# Altium schematic sheet REUN.468349.001_PSU_Board_Connectors.SchDoc: Плата распределения
size 420 x 297 mm; Date: 10.06.22; ApprovedBy: Шавликов; CheckedBy: Мамаев; DrawnBy: Подлесный; DocumentNumber: РЕУН.468349.001 Э3 2D; SheetNumber: 1; SheetTotal: 7; Title1str: питания; DocumentType: Схема электрическая принципиальная; Format: A3; ImagePath: РЕУН.468349.001 ТЭ
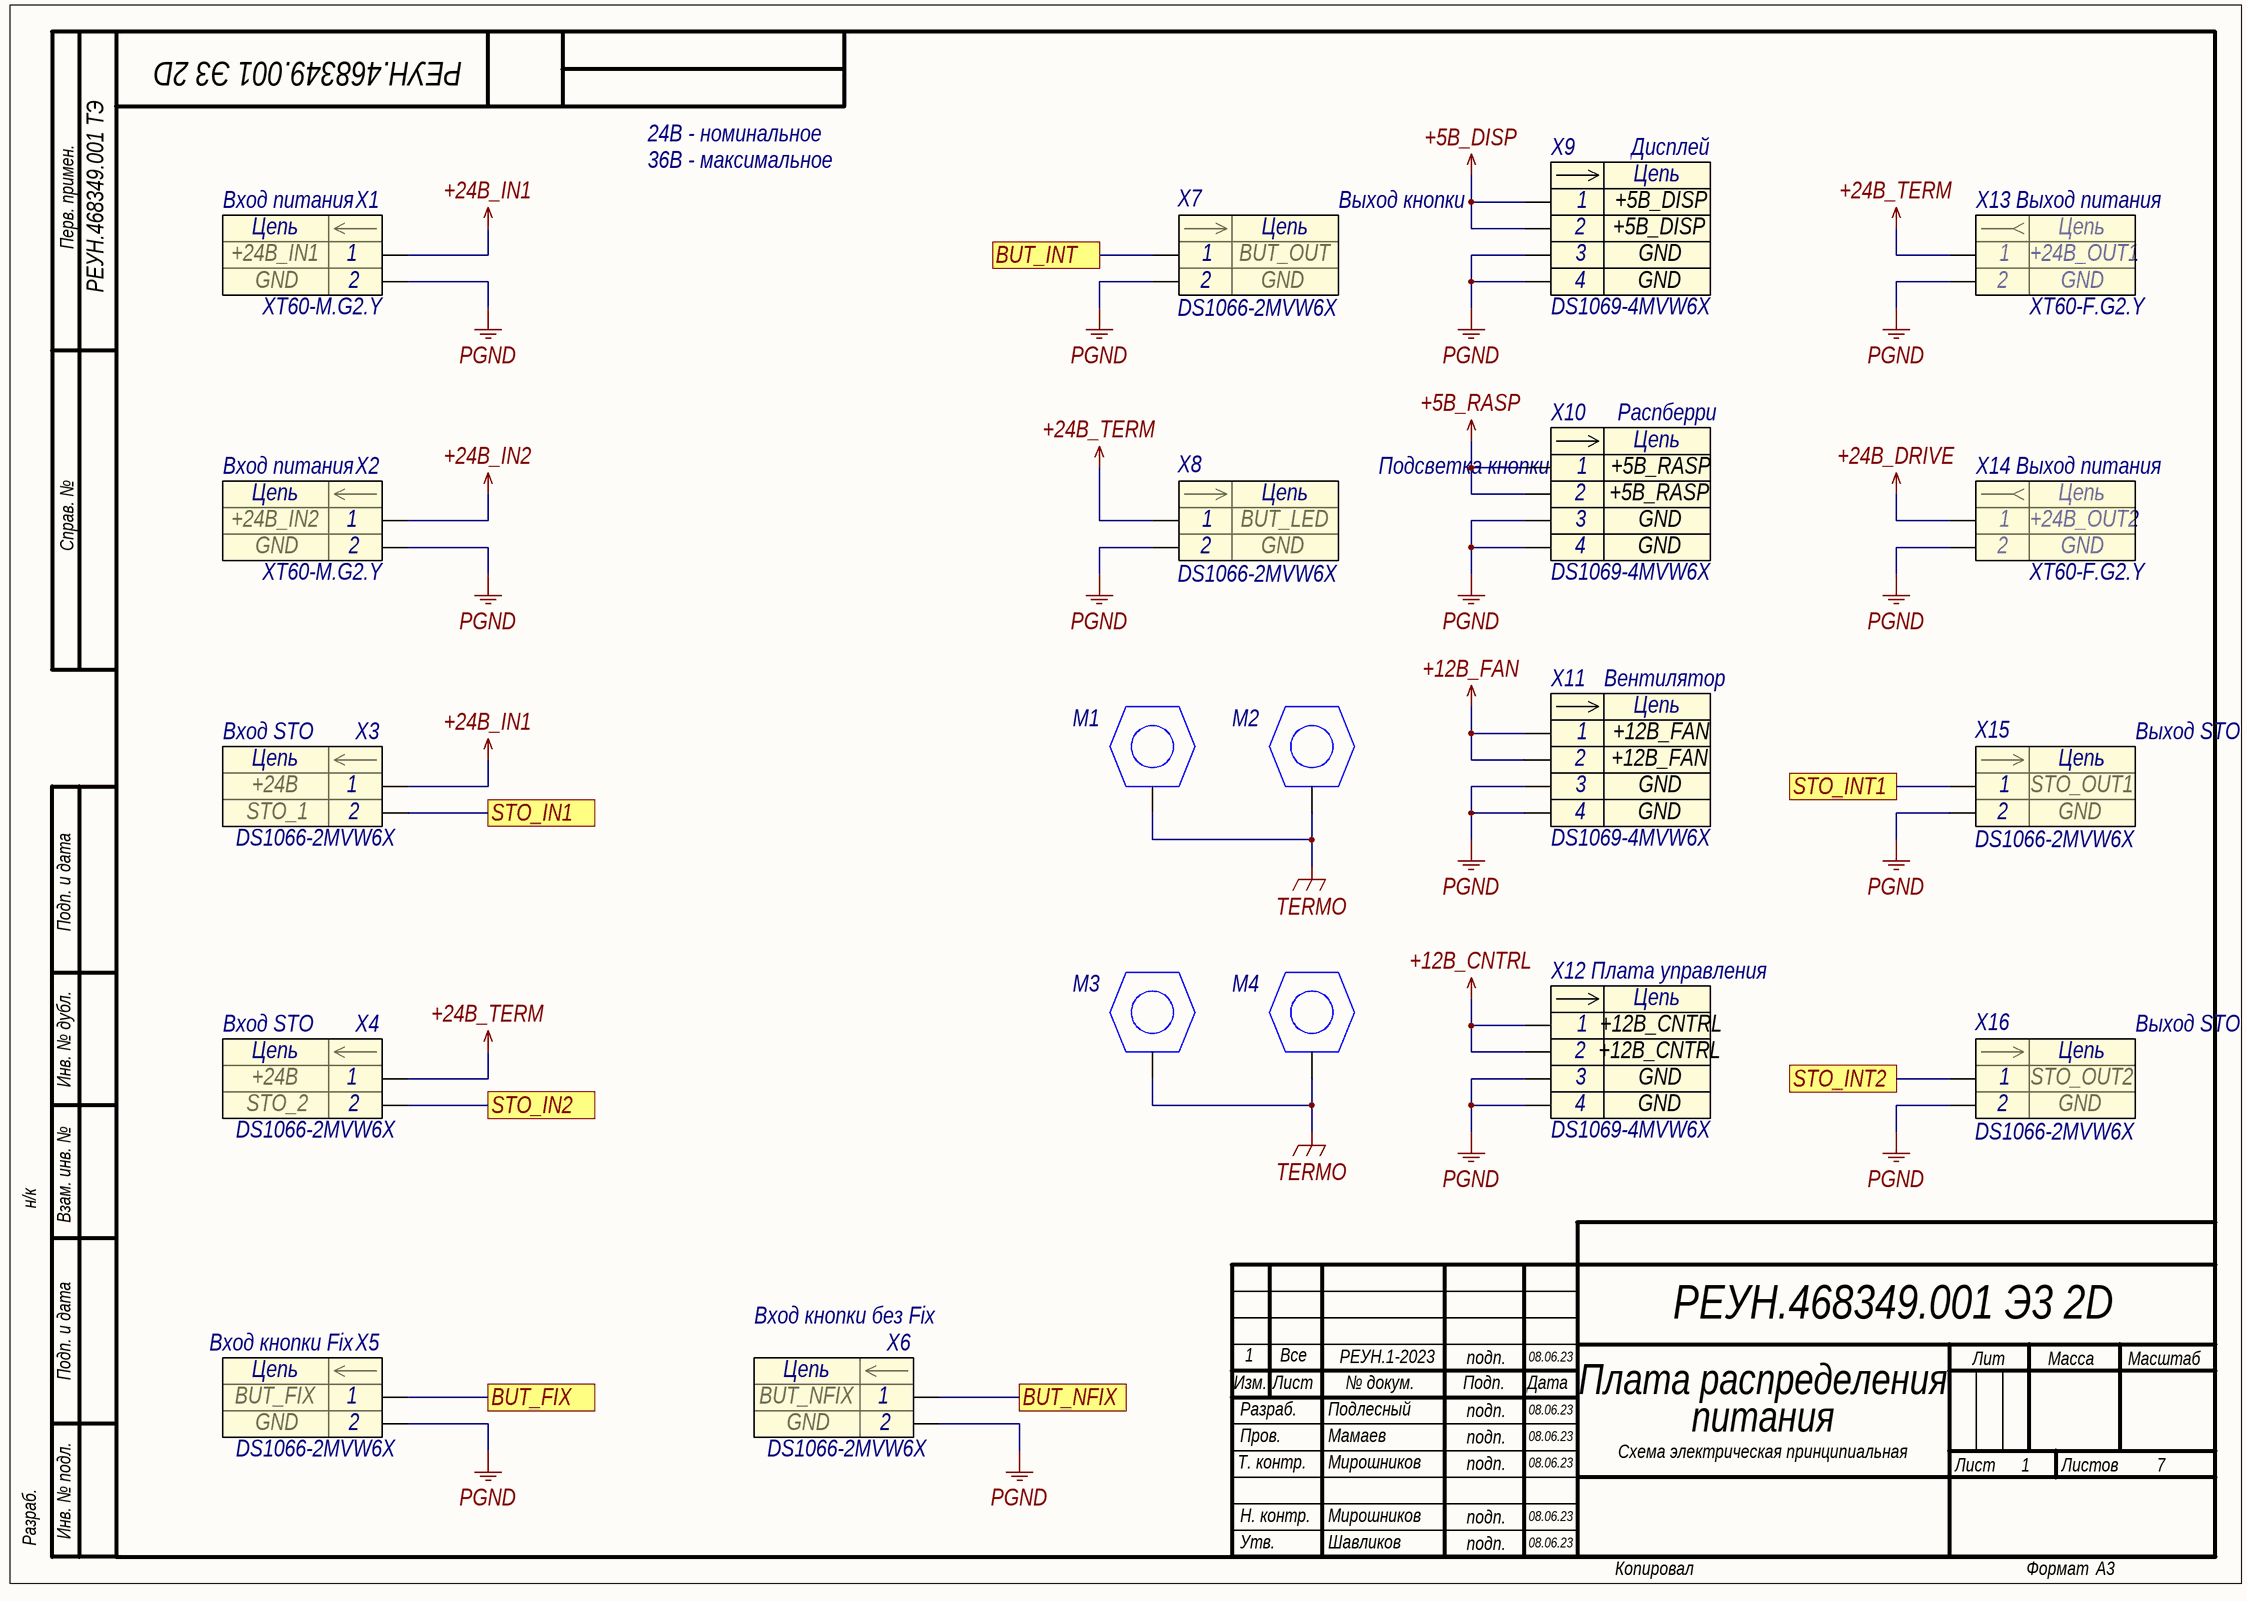
[diagram p0: REUN.468349.001_PSU_Board_Connectors.SchDoc]

## Parts
M1  SCREW  [SCREW3.5]  (value not drawn)
M2  SCREW  [SCREW3.5]  (value not drawn)
M3  SCREW  [SCREW3.5]  (value not drawn)
M4  SCREW  [SCREW3.5]  (value not drawn)
X1  XT60-M.G2.Y  [XT60-M_TH]
X2  XT60-M.G2.Y  [XT60-M_TH]
X3  DS1066-2MVW6X  [MW-2M]
X4  DS1066-2MVW6X  [MW-2M]
X5  DS1066-2MVW6X  [MW-2M]
X6  DS1066-2MVW6X  [MW-2M]
X7  DS1066-2MVW6X  [MW-2M]
X8  DS1066-2MVW6X  [MW-2M]
X9  DS1069-4MVW6X  [CWF-4]
X10  DS1069-4MVW6X  [CWF-4]
X11  DS1069-4MVW6X  [CWF-4]
X12  DS1069-4MVW6X  [CWF-4]
X13  XT60-F.G2.Y  [XT60-F_TH]
X14  XT60-F.G2.Y  [XT60-F_TH]
X15  DS1066-2MVW6X  [MW-2M]
X16  DS1066-2MVW6X  [MW-2M]

## Ports
BUT_FIX, BUT_INT, BUT_NFIX, STO_IN1, STO_IN2, STO_INT1, STO_INT2

## Nets
+5B_DISP: X9.1 X9.2
+5B_RASP: X10.1 X10.2
+12B_CNTRL: X12.1 X12.2
+12B_FAN: X11.1 X11.2
+24B_DRIVE: X14.1
+24B_IN1: X1.1 X3.1
+24B_IN2: X2.1
+24B_TERM: X4.1 X8.1 X13.1
PGND: X1.2 X2.2 X5.2 X6.2 X7.2 X8.2 X9.3 X9.4 X10.3 X10.4 X11.3 X11.4 X12.3 X12.4 X13.2 X14.2 X15.2 X16.2
TERMO: M1.1 M2.1 M3.1 M4.1
BUT_FIX: X5.1 ; port BUT_FIX
BUT_INT: X7.1 ; port BUT_INT
BUT_NFIX: X6.1 ; port BUT_NFIX
STO_IN1: X3.2 ; port STO_IN1
STO_IN2: X4.2 ; port STO_IN2
STO_INT1: X15.1 ; port STO_INT1
STO_INT2: X16.1 ; port STO_INT2

## Notes on the sheet
- Перв. примен.
- 24В - номинальное
- 36В - максимальное
- Дисплей
- (near X1) Вход питания
- (near X7) Выход кнопки
- Выход питания
- Распберри
- Справ. №
- (near X2) Вход питания
- (near X8) Подсветка кнопки
- Вентилятор
- Вход STO
- Выход STO
- Подп. и дата
- Плата управления
- Инв. № дубл.
- н/к
- Взам. инв. №
- Вход кнопки без Fix
- (near X5) Вход кнопки Fix
- 1
- Изм.
- Все
- Лист
- РЕУН.1-2023
- № докум.
- подп.
- Подп.
- 08.06.23
- Дата
- Лит
- Масса
- Масштаб
- Т. контр.
- Пров.
- Разраб.
- Мирошников
- Листов
- Инв. № подл.
- Н. контр.
- Утв.
- Копировал
- Формат
- (in symbol connect76) Цепь
- (in symbol connect215) Цепь
- (in symbol connect216) Цепь
- (in symbol connect233) Цепь

## Library data of the parts
X1 = connect216: Разъем - 2 конт. вилка; Part Name: XT60-M; Manufacture: Amass Electronics; Contact_1: +24B_IN1; Contact_2: GND; Etch: 7.2mm; id: connect216; Part Number: XT60-M.G2.Y
X2 = connect216: Разъем - 2 конт. вилка; Part Name: XT60-M; Manufacture: Amass Electronics; Contact_1: +24B_IN2; Contact_2: GND; Etch: 7.2mm; id: connect216; Part Number: XT60-M.G2.Y
X3 = connect76: Разъем - 2 конт. вилка; Part Name: Вилка на плату прямая 2мм 2pin; Manufacture: Ningbo connfly electronic; Contact_1: +24В; Contact_2: STO_1; Etch: 2mm; id: connect76; Part Number: DS1066-2MVW6X
X4 = connect76: Разъем - 2 конт. вилка; Part Name: Вилка на плату прямая 2мм 2pin; Manufacture: Ningbo connfly electronic; Contact_1: +24В; Contact_2: STO_2; Etch: 2mm; id: connect76; Part Number: DS1066-2MVW6X
X5 = connect76: Разъем - 2 конт. вилка; Part Name: Вилка на плату прямая 2мм 2pin; Manufacture: Ningbo connfly electronic; Contact_1: BUT_FIX; Contact_2: GND; Etch: 2mm; id: connect76; Part Number: DS1066-2MVW6X
X6 = connect76: Разъем - 2 конт. вилка; Part Name: Вилка на плату прямая 2мм 2pin; Manufacture: Ningbo connfly electronic; Contact_1: BUT_NFIX; Contact_2: GND; Etch: 2mm; id: connect76; Part Number: DS1066-2MVW6X
X7 = connect76: Разъем - 2 конт. вилка; Part Name: Вилка на плату прямая 2мм 2pin; Manufacture: Ningbo connfly electronic; Contact_1: BUT_OUT; Contact_2: GND; Etch: 2mm; id: connect76; Part Number: DS1066-2MVW6X
X8 = connect76: Разъем - 2 конт. вилка; Part Name: Вилка на плату прямая 2мм 2pin; Manufacture: Ningbo connfly electronic; Contact_1: BUT_LED; Contact_2: GND; Etch: 2mm; id: connect76; Part Number: DS1066-2MVW6X
X9 = connect233: Разъем - 4 конт. вилка; Part Name: Вилка прямая на плату; Manufacture: Connfly electronic; Contact_1: +5B_DISP; Contact_3: GND; Etch: 2.5мм; Contact_2: +5B_DISP; Contact_4: GND; id: connect233; Part Number: DS1069-4MVW6X
X10 = connect233: Разъем - 4 конт. вилка; Part Name: Вилка прямая на плату; Manufacture: Connfly electronic; Contact_1: +5B_RASP; Contact_3: GND; Etch: 2.5мм; Contact_2: +5B_RASP; Contact_4: GND; id: connect233; Part Number: DS1069-4MVW6X
X11 = connect233: Разъем - 4 конт. вилка; Part Name: Вилка прямая на плату; Manufacture: Connfly electronic; Contact_1: +12B_FAN; Contact_3: GND; Etch: 2.5мм; Contact_2: +12B_FAN; Contact_4: GND; id: connect233; Part Number: DS1069-4MVW6X
X12 = connect233: Разъем - 4 конт. вилка; Part Name: Вилка прямая на плату; Manufacture: Connfly electronic; Contact_1: +12B_CNTRL; Contact_3: GND; Etch: 2.5мм; Contact_2: +12B_CNTRL; Contact_4: GND; id: connect233; Part Number: DS1069-4MVW6X
X13 = connect215: Разъем - 2 конт. розетка; Part Name: XT60-F; Manufacture: Amass Electronics; Contact_1: +24B_OUT1; Contact_2: GND; Etch: 7.2mm; id: connect215; Part Number: XT60-F.G2.Y
X14 = connect215: Разъем - 2 конт. розетка; Part Name: XT60-F; Manufacture: Amass Electronics; Contact_1: +24B_OUT2; Contact_2: GND; Etch: 7.2mm; id: connect215; Part Number: XT60-F.G2.Y
X15 = connect76: Разъем - 2 конт. вилка; Part Name: Вилка на плату прямая 2мм 2pin; Manufacture: Ningbo connfly electronic; Contact_1: STO_OUT1; Contact_2: GND; Etch: 2mm; id: connect76; Part Number: DS1066-2MVW6X
X16 = connect76: Разъем - 2 конт. вилка; Part Name: Вилка на плату прямая 2мм 2pin; Manufacture: Ningbo connfly electronic; Contact_1: STO_OUT2; Contact_2: GND; Etch: 2mm; id: connect76; Part Number: DS1066-2MVW6X